# EAGLE schematic multi-vca (EAGLE 9.6.1)
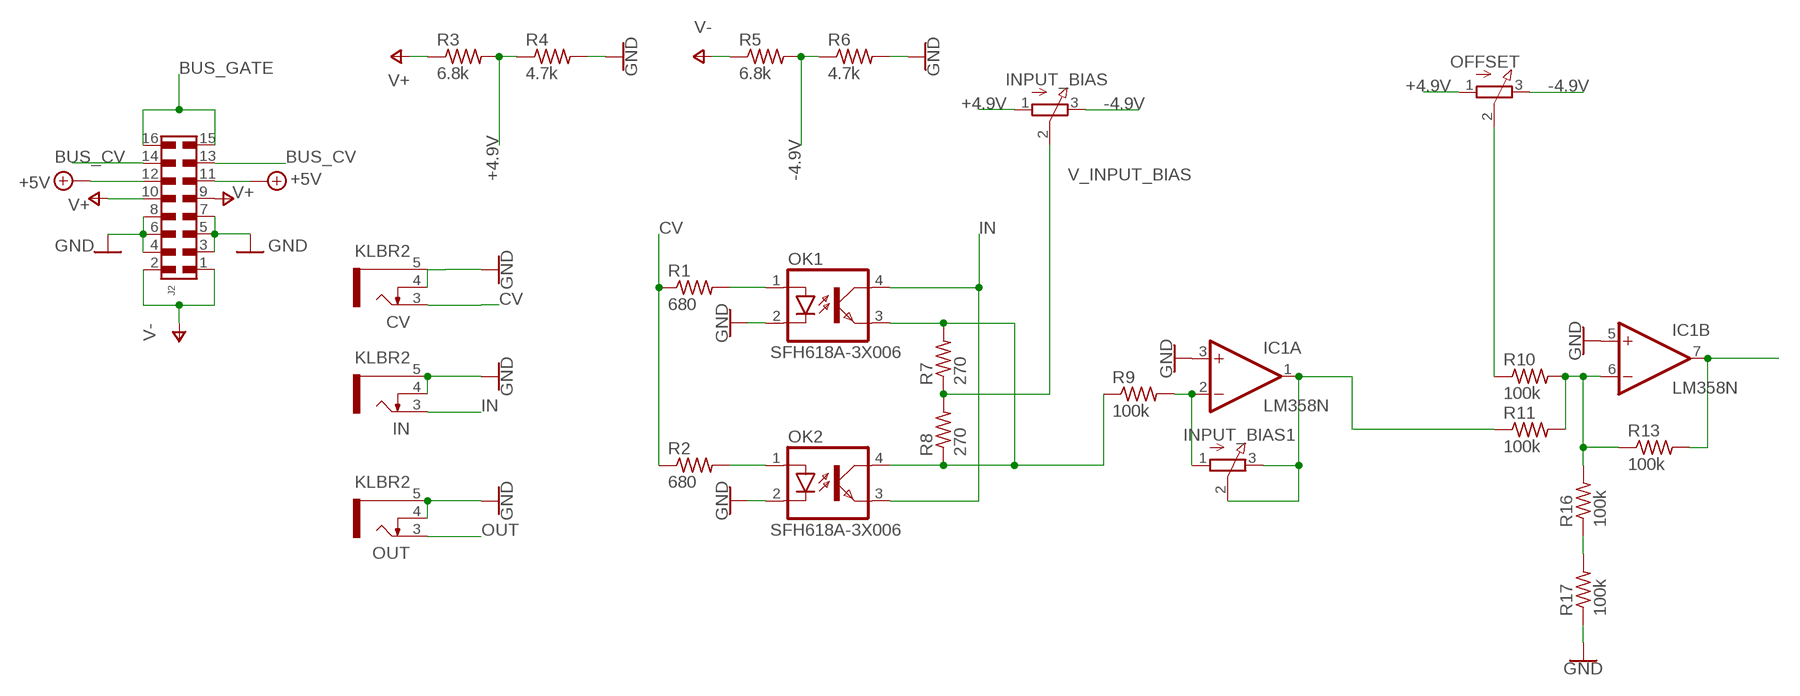
[diagram p0: schematic, sheet 1]

## Parts
CV  KLBR2  [KLBR2]
IC1  LM358N  [DIL08]
IN  KLBR2  [KLBR2]
INPUT_BIAS  3RP/1610N  [3RP/1610N]
INPUT_BIAS1  3RP/1610N  [3RP/1610N]
J2  6120XX20621_61201620621  [61201620621]
OFFSET  3RP/1610N  [3RP/1610N]
OK1  SFH618A-3X006  [DIP4-400]
OK2  SFH618A-3X006  [DIP4-400]
OUT  KLBR2  [KLBR2]
R1  680  R-US_0204/7  [0204/7]
R2  680  R-US_0204/7  [0204/7]
R3  6.8k  R-US_0204/7  [0204/7]
R4  4.7k  R-US_0204/7  [0204/7]
R5  6.8k  R-US_0204/7  [0204/7]
R6  4.7k  R-US_0204/7  [0204/7]
R7  270  R-US_0204/7  [0204/7]
R8  270  R-US_0204/7  [0204/7]
R9  100k  R-US_0204/7  [0204/7]
R10  100k  R-US_0204/7  [0204/7]
R11  100k  R-US_0204/7  [0204/7]
R13  100k  R-US_0204/7  [0204/7]
R16  100k  R-US_0204/7  [0204/7]
R17  100k  R-US_0204/7  [0204/7]

## Nets
+4.9V: INPUT_BIAS.1(A) OFFSET.1(A) R3.2 R4.1
+5V: J2.11 J2.12
-4.9V: INPUT_BIAS.3(E) OFFSET.3(E) R5.2 R6.1
BUS_CV: J2.13 J2.14
BUS_GATE: J2.15 J2.16
CV: CV.3 R1.1 R2.1
GND: CV.4 CV.5 IC1.3(A:+IN) IC1.5(B:+IN) IN.4 IN.5 J2.3 J2.4 J2.5 J2.6 J2.7 J2.8 OK1.2(C) OK2.2(C) OUT.4 OUT.5 R4.2 R6.2 R17.1
IN: IN.3 OK1.4(COL) OK2.3(EMIT)
N$1: OK1.1(A) R1.2
N$2: OK2.1(A) R2.2
N$3: IC1.1(A:OUT) INPUT_BIAS1.2(S) INPUT_BIAS1.3(E) R11.1
N$4: OK1.3(EMIT) OK2.4(COL) R7.2 R8.1 R9.1
N$5: IC1.2(A:-IN) INPUT_BIAS1.1(A) R9.2
N$7: IC1.6(B:-IN) R10.2 R11.2 R13.1 R16.2
N$8: IC1.7(B:OUT) R13.2
N$10: R16.1 R17.2
OUT: OUT.3
V+: J2.9 J2.10 R3.1
V-: J2.1 J2.2 R5.1
V_INPUT_BIAS: INPUT_BIAS.2(S) R7.1 R8.2
V_INPUT_BIAS1: OFFSET.2(S) R10.1

## Power pins joined to a net without a drawn wire
V+: IC1.8(P:V+)
V-: IC1.4(P:V-)

## Library data of the parts
CV IN OUT = con-lumberg:KLBR?: Jack connectors according to JISC 6560, 2.5mm / 3.5 mm Klinkensteckverbinder nach JISC 6560, 2.5mm / 3,5 mm Source: http://www.lumberg.com/Produkte/PDFs/KLBR2.pdf www.lumberg.com/Produkte/PDFs/KLBR1.pdf; OC_FARNELL: unknown; OC_NEWARK: unknown
IC1 = linear:LM358: OP AMP also LM158; LM258; LM2904 Source: http://cache.national.com/ds/LM/LM158.pdf
INPUT_BIAS INPUT_BIAS1 OFFSET = pot:3RP/1610N: 16mm Potentiometer one level Source: http://www.alphapotentiometers.net/html/16mm_pot_2.html
J2 = Wurth_Connectors_WR-BHD:6120XX20621_61201620621: WR-BHD 2.54 mm Male SMT Box Header KIND PROPERTIES: Pitch 2.54 mm Gender:Male MATERIAL PROPERTIES: Insulator Material:PA6T Insulator Flammability Rating UL94 V-0 Insulator Color:Black Contact Material :Copper Alloy Contact Plating :Gold Contact Type: Stamped GENERAL INFORMATION: Operating Temperature:-40 °C up to +125 °C Compliance:RoHS Working Voltage: 250 V (AC) Withstanding Voltage:500 V (AC) Contact Resistance: 20 mΩ Insulation Resistance:1000 MΩ CERTIFICATION: UL Approval:E323964 PACKAGING PROPERTIES Packaging :Tube <https://katalog.we-online.com/media/images/v2/o32919v209%20Family_WR-BHD_612xxx20621.jpg> Details see: https://katalog.we-online.com/en/em/BHD_2_54_SMT_MALE_BOX_HEADER_6120XX20621 Updated by Yingchun,Shan 2019-10-30 2019 (C) Würth Elektronik; CONTACT-RESISTANCE: 20mOhm; DATASHEET-URL: https://katalog.we-online.com/em/datasheet/61201620621.pdf; GENDER: Male; IR: 3A; L: 28.12mm; MOUNT: SMT; PACKAGING: Tube; PART-NUMBER: 61201620621; PINS: 16; PITCH: 2.54mm; TOL-R: max.; TYPE: Straight; WORKING-VOLTAGE: 250V(AC)
OK1 OK2 = optocoupler:SFH618?*: Optocoupler, Phototransistor Output, Low Input Current Source: Data sheet <http://www.vishay.com/docs/83673/sfh618.pdf>; MPN: SFH618A-3X006; OC_FARNELL: unknown; OC_NEWARK: 43K9541
R1-R11 R13 R16 R17 = rcl:R-US_: RESISTOR, American symbol; SPICEPREFIX: R